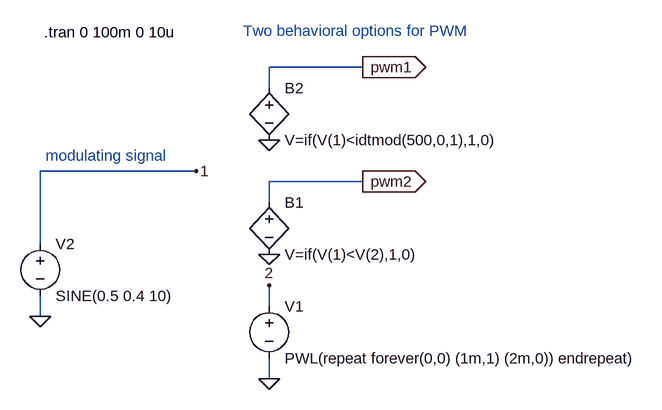
[diagram p0: schematic PwmBehavioral.asc]
PwmBehavioral.asc, the LTspice schematic file:
Version 4
SHEET 1 880 680
WIRE -320 304 -320 192
WIRE -320 416 -320 384
WIRE -80 192 -320 192
WIRE 32 64 32 32
WIRE 32 240 32 208
WIRE 32 400 32 368
WIRE 32 512 32 480
WIRE 176 32 32 32
WIRE 176 208 32 208
FLAG 32 512 0
FLAG 32 368 2
FLAG 32 320 0
FLAG 176 208 pwm2
IOPIN 176 208 Out
FLAG -320 416 0
FLAG -80 192 1
FLAG 32 144 0
FLAG 176 32 pwm1
IOPIN 176 32 Out
SYMBOL voltage 32 384 R0
WINDOW 123 0 0 Left 0
WINDOW 39 0 0 Left 0
SYMATTR InstName V1
SYMATTR Value PWL(repeat forever(0,0) (1m,1) (2m,0)) endrepeat)
SYMBOL bv 32 224 R0
SYMATTR InstName B1
SYMATTR Value V=if(V(1)<V(2),1,0)
SYMBOL voltage -320 288 R0
WINDOW 123 0 0 Left 0
WINDOW 39 0 0 Left 0
SYMATTR InstName V2
SYMATTR Value SINE(0.5 0.4 10)
SYMBOL bv 32 48 R0
SYMATTR InstName B2
SYMATTR Value V=if(V(1)<idtmod(500,0,1),1,0)
TEXT -314 -22 Left 0 !.tran 0 100m 0 10u
TEXT -8 -24 Left 0 ;Two behavioral options for PWM
TEXT -312 168 Left 0 ;modulating signal

The netlist it stands for:
* PwmBehavioral.asc
V1 2 0 PWL(repeat forever(0,0) (1m,1) (2m,0)) endrepeat)
B1 pwm2 0 V=if(V(1)<V(2),1,0)
V2 1 0 SINE(0.5 0.4 10)
B2 pwm1 0 V=if(V(1)<idtmod(500,0,1),1,0)
.tran 0 100m 0 10u
* Two behavioral options for PWM
* modulating signal
.backanno
.end